# EAGLE schematic PWR (EAGLE 7.7.0)
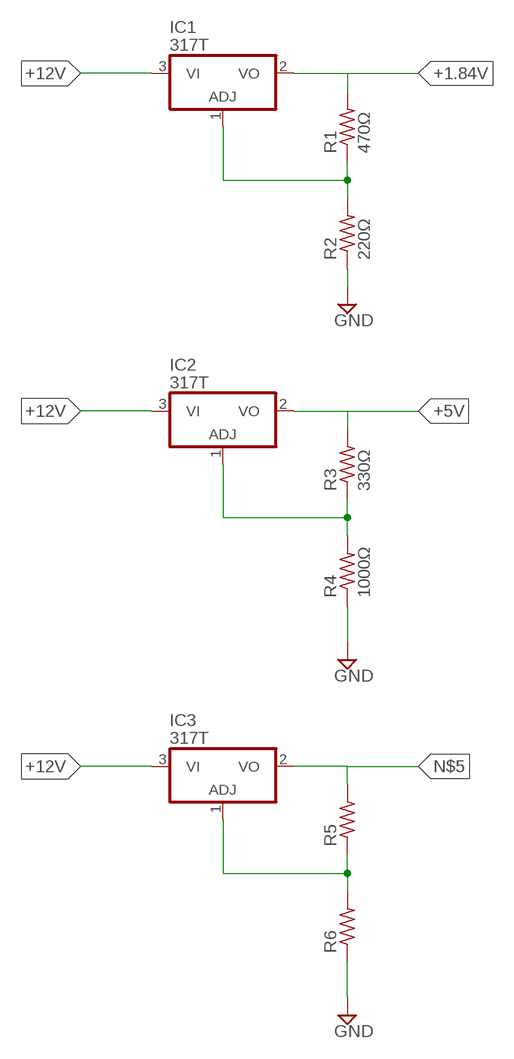
[diagram p0: schematic, sheet 1]

## Parts
IC1  317T  [TO220H]
IC2  317T  [TO220H]
IC3  317T  [TO220H]
R1  470Ω  R-US_0204/7  [0204/7]
R2  220Ω  R-US_0204/7  [0204/7]
R3  330Ω  R-US_0204/7  [0204/7]
R4  1000Ω  R-US_0204/7  [0204/7]
R5  R-US_0204/7  [0204/7]
R6  R-US_0204/7  [0204/7]

## Nets
+1.84V: IC1.2(VO) R1.2
+5V: IC2.2(VO) R3.2
+12V: IC1.3(VI) IC2.3(VI) IC3.3(VI)
GND: R2.1 R4.1 R6.1
N$1: IC1.1(ADJ) R1.1 R2.2
N$3: IC2.1(ADJ) R3.1 R4.2
N$4: IC3.1(ADJ) R5.1 R6.2
N$5: IC3.2(VO) R5.2

## Library data of the parts
IC1-IC3 = linear:*317: Positive VOLTAGE REGULATOR
R1-R6 = rcl:R-US_: RESISTOR, American symbol